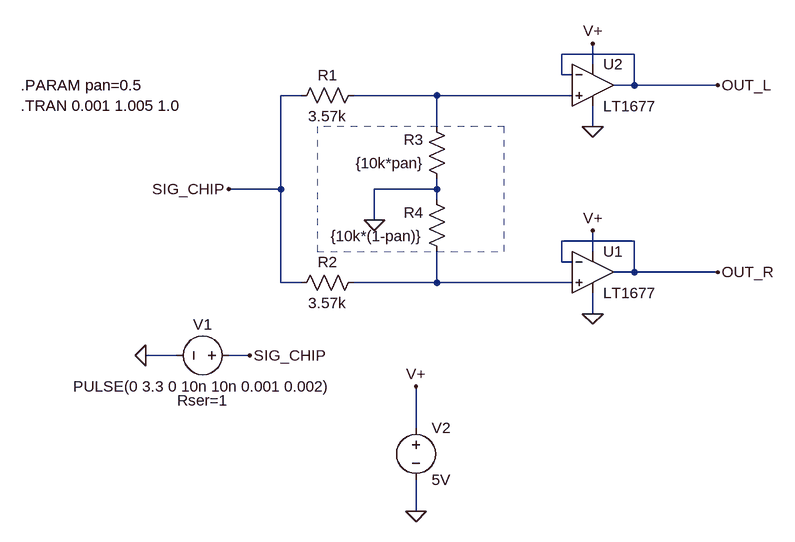
[diagram p0: schematic audio_panning_stage.asc]
audio_panning_stage.asc, the LTspice schematic file:
Version 4
SHEET 1 880 720
WIRE 464 0 352 0
WIRE 400 16 400 -16
WIRE 352 32 352 0
WIRE 368 32 352 32
WIRE 464 48 464 0
WIRE 464 48 432 48
WIRE 592 48 464 48
WIRE -48 64 -80 64
WIRE 160 64 32 64
WIRE 368 64 160 64
WIRE 160 112 160 64
WIRE 400 112 400 80
WIRE -80 208 -80 64
WIRE -80 208 -160 208
WIRE 160 208 160 192
WIRE 160 208 64 208
WIRE 160 224 160 208
WIRE 64 256 64 208
WIRE 464 288 352 288
WIRE 400 304 400 272
WIRE 352 320 352 288
WIRE 368 320 352 320
WIRE 464 336 464 288
WIRE 464 336 432 336
WIRE 592 336 464 336
WIRE -80 352 -80 208
WIRE -48 352 -80 352
WIRE 160 352 160 304
WIRE 160 352 32 352
WIRE 368 352 160 352
WIRE 400 400 400 368
WIRE -240 464 -288 464
WIRE -128 464 -160 464
WIRE 128 576 128 512
WIRE 128 704 128 656
FLAG -160 208 SIG_CHIP
FLAG 64 256 0
FLAG -128 464 SIG_CHIP
FLAG -288 464 0
FLAG 128 704 0
FLAG 128 512 V+
FLAG 400 -16 V+
FLAG 400 272 V+
FLAG 400 400 0
FLAG 400 112 0
FLAG 592 48 OUT_L
FLAG 592 336 OUT_R
SYMBOL res 48 48 R90
WINDOW 0 0 56 VBottom 2
WINDOW 3 32 56 VTop 2
SYMATTR InstName R1
SYMATTR Value 3.57k
SYMBOL res 48 336 R90
WINDOW 0 0 56 VBottom 2
WINDOW 3 32 56 VTop 2
SYMATTR InstName R2
SYMATTR Value 3.57k
SYMBOL res 176 208 R180
WINDOW 0 36 76 Left 2
WINDOW 3 36 40 Left 2
SYMATTR InstName R3
SYMATTR Value {10k*pan}
SYMBOL res 176 320 R180
WINDOW 0 36 76 Left 2
WINDOW 3 36 40 Left 2
SYMATTR InstName R4
SYMATTR Value {10k*(1-pan)}
SYMBOL voltage -144 464 R90
WINDOW 0 -32 56 VBottom 2
WINDOW 3 32 56 VTop 2
WINDOW 39 54 56 VTop 2
SYMATTR InstName V1
SYMATTR Value PULSE(0 3.3 0 10n 10n 0.001 0.002)
SYMATTR SpiceLine Rser=1
SYMATTR Value2 AC 3.3
SYMBOL Opamps/LT1677 400 272 R0
SYMATTR InstName U1
SYMBOL Opamps/LT1677 400 -16 R0
SYMATTR InstName U2
SYMBOL voltage 128 560 R0
SYMATTR InstName V2
SYMATTR Value 5V
TEXT -480 48 Left 2 !.PARAM pan=0.5\n.TRAN 0.001 1.005 1.0
RECTANGLE Normal 264 112 -24 304 3

The netlist it stands for:
* audio_panning_stage.asc
R1 N001 SIG_CHIP 3.57k
R2 N002 SIG_CHIP 3.57k
R3 0 N001 {10k*pan}
R4 N002 0 {10k*(1-pan)}
V1 SIG_CHIP 0 PULSE(0 3.3 0 10n 10n 0.001 0.002) AC 3.3 Rser=1
XU1 N002 OUT_R V+ 0 OUT_R LT1677  ; pins In+ In- V+ V- OUT
XU2 N001 OUT_L V+ 0 OUT_L LT1677  ; pins In+ In- V+ V- OUT
V2 V+ 0 5V
.PARAM pan=0.5
.TRAN 0.001 1.005 1.0
.lib LTC.lib
.backanno
.end